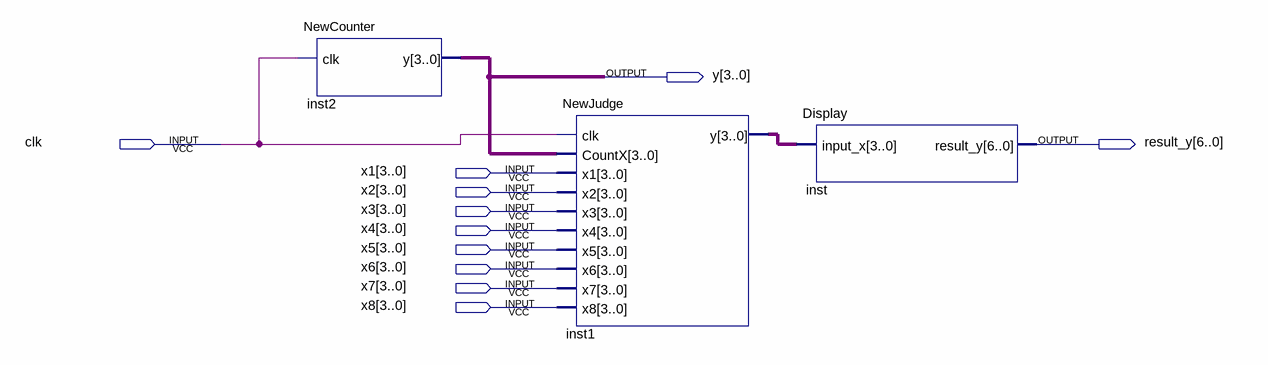
[diagram p0: schematic sheet]
// Quartus schematic PhantomDestriersDisplay.bdf as structural Verilog: 3 symbols, 11 pins
module PhantomDestriersDisplay (
  input  clk,
  input  [3:0] x1,
  input  [3:0] x2,
  input  [3:0] x3,
  input  [3:0] x4,
  input  [3:0] x5,
  input  [3:0] x6,
  input  [3:0] x7,
  input  [3:0] x8,
  output [3:0] y,
  output [6:0] result_y
);

  wire [3:0] inst1_y;

  NewCounter inst2 (.clk(clk), .y(y));
  NewJudge inst1 (
    .clk(clk), .CountX(y), .x1(x1), .x2(x2), .x3(x3), .x4(x4), .x5(x5), .x6(x6), .x7(x7), .x8(x8), .y(inst1_y));
  Display inst (.input_x(inst1_y), .result_y(result_y));
endmodule
